# Altium schematic sheet CAN-SW.SchDoc
size A4; DrawnBy: Emile Renaud; Revision: V1.0; SheetNumber: 4; SheetTotal: 8
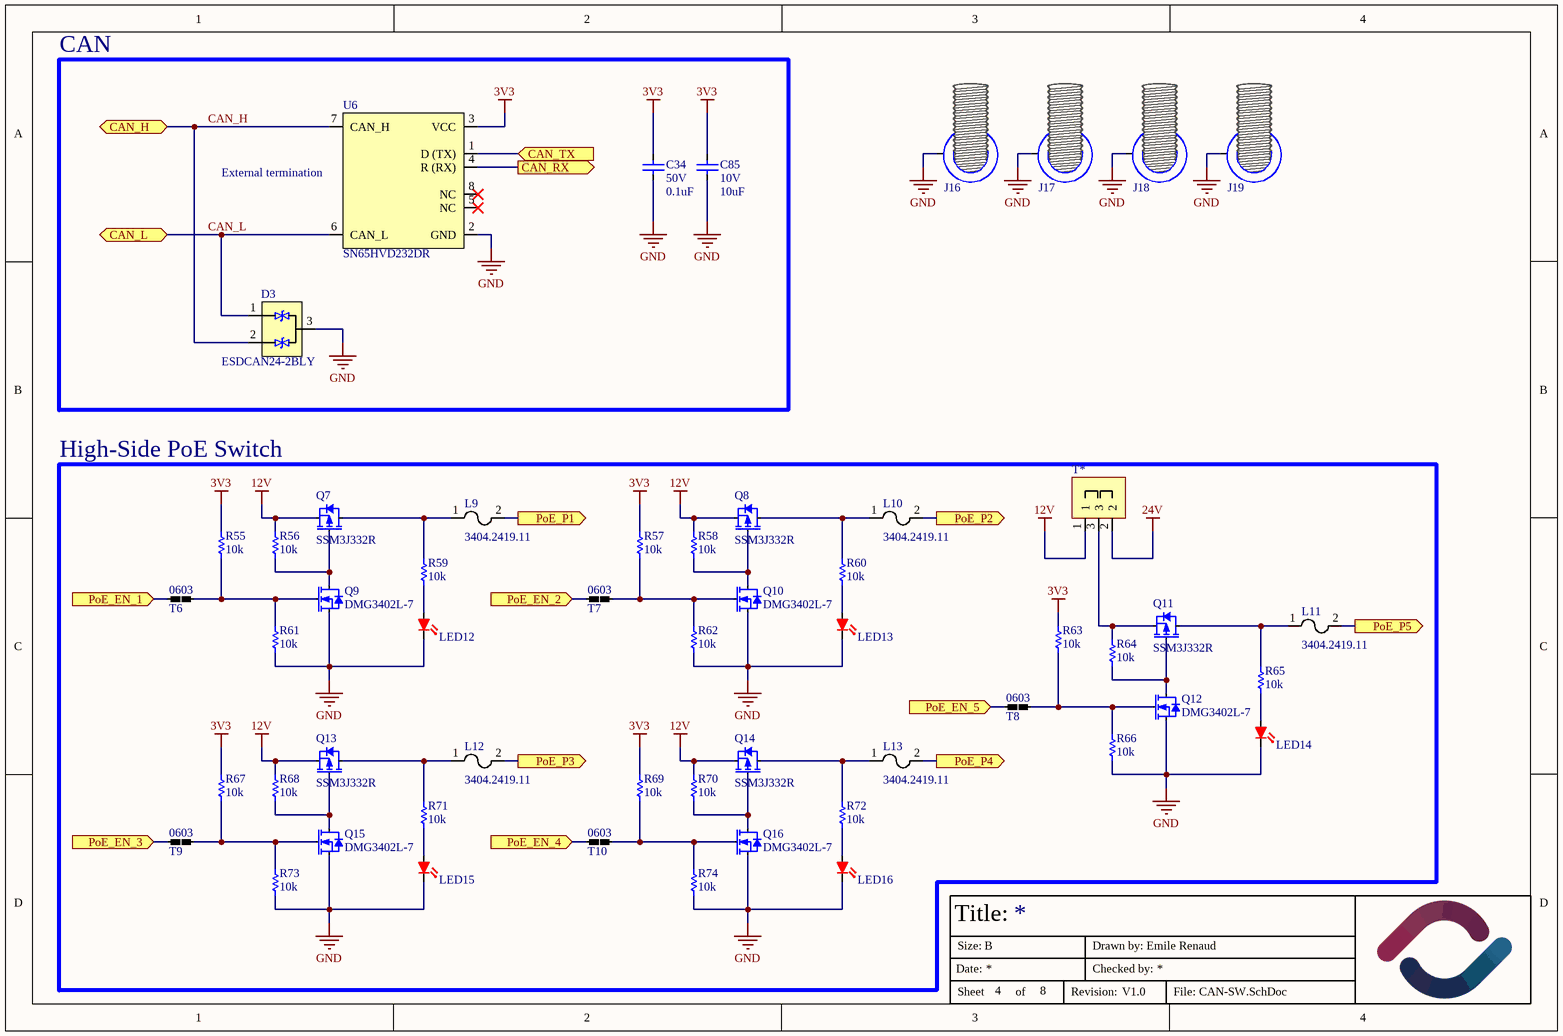
[diagram p0: CAN-SW.SchDoc]

## Parts
C34  value 0.1uF  Volt: 50V  [CAPACITOR-0603]  (hidden comment: Capacitor-0603-0.1uF-50V-X7R)
C85  value 10uF  Volt: 10V  [CAPACITOR-0603]  (hidden comment: Capacitor-0603-10uF-10V-X5R)
D3  ESDCAN24-2BLY  [SOT-23-3]
J16  hole  [HOLE-3.40MM-M3-8MMEYELET]  (value not drawn)  (no BOM)
J17  hole  [HOLE-3.40MM-M3-8MMEYELET]  (value not drawn)  (no BOM)
J18  hole  [HOLE-3.40MM-M3-8MMEYELET]  (value not drawn)  (no BOM)
J19  hole  [HOLE-3.40MM-M3-8MMEYELET]  (value not drawn)  (no BOM)
L9  3404.2419.11  [2-SMD-Fuse]
L10  3404.2419.11  [2-SMD-Fuse]
L11  3404.2419.11  [2-SMD-Fuse]
L12  3404.2419.11  [2-SMD-Fuse]
L13  3404.2419.11  [2-SMD-Fuse]
LED12  B1911USD-20D000114U1930  [LED-0603-2PIN]  (value not drawn)
LED13  B1911USD-20D000114U1930  [LED-0603-2PIN]  (value not drawn)
LED14  B1911USD-20D000114U1930  [LED-0603-2PIN]  (value not drawn)
LED15  B1911USD-20D000114U1930  [LED-0603-2PIN]  (value not drawn)
LED16  B1911USD-20D000114U1930  [LED-0603-2PIN]  (value not drawn)
Q7  SSM3J332R  [SOT-23-3]
Q8  SSM3J332R  [SOT-23-3]
Q9  DMG3402L-7  [SOT-23-3]
Q10  DMG3402L-7  [SOT-23-3]
Q11  SSM3J332R  [SOT-23-3]
Q12  DMG3402L-7  [SOT-23-3]
Q13  SSM3J332R  [SOT-23-3]
Q14  SSM3J332R  [SOT-23-3]
Q15  DMG3402L-7  [SOT-23-3]
Q16  DMG3402L-7  [SOT-23-3]
R55  value 10k  [Resistor-0603]  (hidden comment: SMT resistor)
R56  value 10k  [Resistor-0603]  (hidden comment: SMT resistor)
R57  value 10k  [Resistor-0603]  (hidden comment: SMT resistor)
R58  value 10k  [Resistor-0603]  (hidden comment: SMT resistor)
R59  value 10k  [Resistor-0603]  (hidden comment: SMT resistor)
R60  value 10k  [Resistor-0603]  (hidden comment: SMT resistor)
R61  value 10k  [Resistor-0603]  (hidden comment: SMT resistor)
R62  value 10k  [Resistor-0603]  (hidden comment: SMT resistor)
R63  value 10k  [Resistor-0603]  (hidden comment: SMT resistor)
R64  value 10k  [Resistor-0603]  (hidden comment: SMT resistor)
R65  value 10k  [Resistor-0603]  (hidden comment: SMT resistor)
R66  value 10k  [Resistor-0603]  (hidden comment: SMT resistor)
R67  value 10k  [Resistor-0603]  (hidden comment: SMT resistor)
R68  value 10k  [Resistor-0603]  (hidden comment: SMT resistor)
R69  value 10k  [Resistor-0603]  (hidden comment: SMT resistor)
R70  value 10k  [Resistor-0603]  (hidden comment: SMT resistor)
R71  value 10k  [Resistor-0603]  (hidden comment: SMT resistor)
R72  value 10k  [Resistor-0603]  (hidden comment: SMT resistor)
R73  value 10k  [Resistor-0603]  (hidden comment: SMT resistor)
R74  value 10k  [Resistor-0603]  (hidden comment: SMT resistor)
T6  NetTie_0603_Short  [NetTie-0603-short]  (value not drawn)
T7  NetTie_0603_Short  [NetTie-0603-short]  (value not drawn)
T8  NetTie_0603_Short  [NetTie-0603-short]  (value not drawn)
T9  NetTie_0603_Short  [NetTie-0603-short]  (value not drawn)
T10  NetTie_0603_Short  [NetTie-0603-short]  (value not drawn)
T*  Jumper-3pos-small  [Jumper-3pos-small]  (value not drawn)
U6  SN65HVD232DR  [SOIC-8]

## Blocks framed on the sheet
CAN: C34 C85 D3 U6
High-Side PoE Switch: L9-L13 LED12-LED16 Q7-Q16 R55-R74 T6-T10 T*

## Ports
CAN_H (bidir), CAN_L (bidir), CAN_RX (out), CAN_TX (in), PoE_EN_1 (in), PoE_EN_2 (in), PoE_EN_3 (in), PoE_EN_4 (in), PoE_EN_5 (in), PoE_P1 (out), PoE_P2 (out), PoE_P3 (out), PoE_P4 (out), PoE_P5 (out)

## Nets
3V3: C34.2 C85.2 R55.2 R57.2 R63.2 R67.2 R69.2 U6.3(VCC)
12V: Q7.2(S) Q8.2(S) Q13.2(S) Q14.2(S) R56.2 R58.2 R68.2 R70.2 T*.1
24V: T*.2
GND: C34.1 C85.1 D3.3(L3) J16.1 J17.1 J18.1 J19.1 LED12.1(K) LED13.1(K) LED14.1(K) LED15.1(K) LED16.1(K) Q9.2(S) Q10.2(S) Q12.2(S) Q15.2(S) Q16.2(S) R61.1 R62.1 R66.1 R73.1 R74.1 U6.2(GND)
CAN_H: D3.2(GND) U6.7(CAN_H) ; port CAN_H
CAN_L: D3.1(L2) U6.6(CAN_L) ; port CAN_L
CAN_RX: U6.4(R_(RX)) ; port CAN_RX
CAN_TX: U6.1(D_(TX)) ; port CAN_TX
PoE_EN_1: T6.2 ; port PoE_EN_1
PoE_EN_2: T7.2 ; port PoE_EN_2
PoE_EN_3: T9.2 ; port PoE_EN_3
PoE_EN_4: T10.2 ; port PoE_EN_4
PoE_EN_5: T8.2 ; port PoE_EN_5
PoE_P1: L9.2 ; port PoE_P1
PoE_P2: L10.2 ; port PoE_P2
PoE_P3: L12.2 ; port PoE_P3
PoE_P4: L13.2 ; port PoE_P4
PoE_P5: L11.2 ; port PoE_P5
NetL9_1: L9.1 Q7.3(D) R59.2
NetL10_1: L10.1 Q8.3(D) R60.2
NetL11_1: L11.1 Q11.3(D) R65.2
NetL12_1: L12.1 Q13.3(D) R71.2
NetL13_1: L13.1 Q14.3(D) R72.2
NetLED12_2: LED12.2(R) R59.1
NetLED13_2: LED13.2(R) R60.1
NetLED14_2: LED14.2(R) R65.1
NetLED15_2: LED15.2(R) R71.1
NetLED16_2: LED16.2(R) R72.1
NetQ7_1: Q7.1(G) Q9.3(D) R56.1
NetQ8_1: Q8.1(G) Q10.3(D) R58.1
NetQ9_1: Q9.1(G) R55.1 R61.2 T6.1
NetQ10_1: Q10.1(G) R57.1 R62.2 T7.1
NetQ11_1: Q11.1(G) Q12.3(D) R64.1
NetQ11_2: Q11.2(S) R64.2 T*.3
NetQ12_1: Q12.1(G) R63.1 R66.2 T8.1
NetQ13_1: Q13.1(G) Q15.3(D) R68.1
NetQ14_1: Q14.1(G) Q16.3(D) R70.1
NetQ15_1: Q15.1(G) R67.1 R73.2 T9.1
NetQ16_1: Q16.1(G) R69.1 R74.2 T10.1

Not connected (* = marked no-connect by the designer): U6 5(NC)* 8(NC)*

## Notes on the sheet
- (near U6) External termination
- Title:
- Date:
- Size:
- B
- Drawn by:
- Checked by:
- Sheet
- of
- Revision:
- File:
- (in symbol NetTie_0603_Short) 0603

## Library data of the parts
C34 = Capacitor-0603-0.1uF-50V-X7R: Precision: X7R-10%; Package / Case: Metric 1608, EIA 0603; Mounted: Yes; Supplier 1: Digi-Key; Supplier Part Number 1: 1276-1935-2-ND; Supplier 2: Digi-Key; Supplier Part Number 2: 1276-1934-2-ND
C85 = Capacitor-0603-10uF-10V-X5R: 10 µF ±20% 10V Ceramic Capacitor X5R 0603 (1608 Metric); Supplier 1: Digikey; Supplier Part Number 1: 4713-GMC10X5R106M10NTCT-ND; Mounted: Yes; Package / Case: Metric 1608 , EIA 0603; Precision: 20%
D3 = ESDCAN24-2BLY: 55V Clamp 6A (8/20µs) Ipp Tvs Diode Surface Mount SOT-23; Volt: 24; Supplier 1: Digi-Key; Supplier Part Number 1: 5272-ESDCAN24-2BLYCT-ND; Mounted: Yes; Package / Case: SOT-23-3
J16-J19 = Hole 3.40mm M3-Eyelet: Hole for M3 Bolt with 8mm pad; Mounted: N/A
L9-L13 = 3404.2419.11: 2 A 277 V AC 250 V DC Fuse Board Mount (Cartridge Style Excluded) Requires Holder, Surface Mount 2-SMD, Square End Block with Clip; Current: 2A; Supplier 1: Digi-Key; Mounted: Yes; Supplier Part Number 1: 486-2091-ND; Package / Case: SMD
LED12-LED16 = B1911USD-20D000114U1930: LED RED CLEAR 0603 SMD; Package / Case: 0603 (1608 Metric); Mounted: Yes; Supplier 1: Digi-Key; Supplier Part Number 1: 3147-B1911USD-20D000114U1930CT-ND
Q7 Q8 Q11 Q13 Q14 = SSM3J332R: P-Channel 30 V 6A (Ta) 1W (Ta) Surface Mount SOT-23F; Volt: 30V; Supplier 1: Digi-Key; Supplier Part Number 1: SSM3J332RLFCT-ND; Package / Case: SOT-523; Mounted: Yes; Current: 6A
Q9 Q10 Q12 Q15 Q16 = DMG3402L-7: N-Channel 30 V 4A (Ta) 1.4W (Ta) Surface Mount SOT-23-3; Volt: 30V; Supplier 1: Digi-Key; Supplier Part Number 1: DMG3402L-7DICT-ND; Package / Case: SOT-23-3; Mounted: Yes; Current: 4A
R55-R74 = Resistor-0603-10k: Resistor0603-10k; Precision: 1%; Watt: 0.1W; Mounted: Yes; Package / Case: Metric 1608, EIA 0603; Supplier 1: Digi-Key; Supplier Part Number 1: 311-10.0KHRTR-ND
U6 = SN65HVD232DR: 1/1 Transceiver Half CANbus 8-SOIC; Package / Case: 8-SOIC; Mounted: Yes; Supplier 1: Digikey; Supplier Part Number 1: 296-26344-1-ND; HelpURL: https://www.ti.com/lit/ds/symlink/sn65hvd230.pdf?HQS=dis-dk-null-digikeymode-dsf-pf-null-wwe&ts=1723930967656&ref_url=https%253A%252F%252Fwww.ti.com%252Fgeneral%252Fdocs%252Fsuppproductinfo.tsp%253FdistId%253D10%2526gotoUrl%253Dhttps%253A%252F%252Fwww.ti.com%252Flit%252Fgpn%252Fsn65hvd230